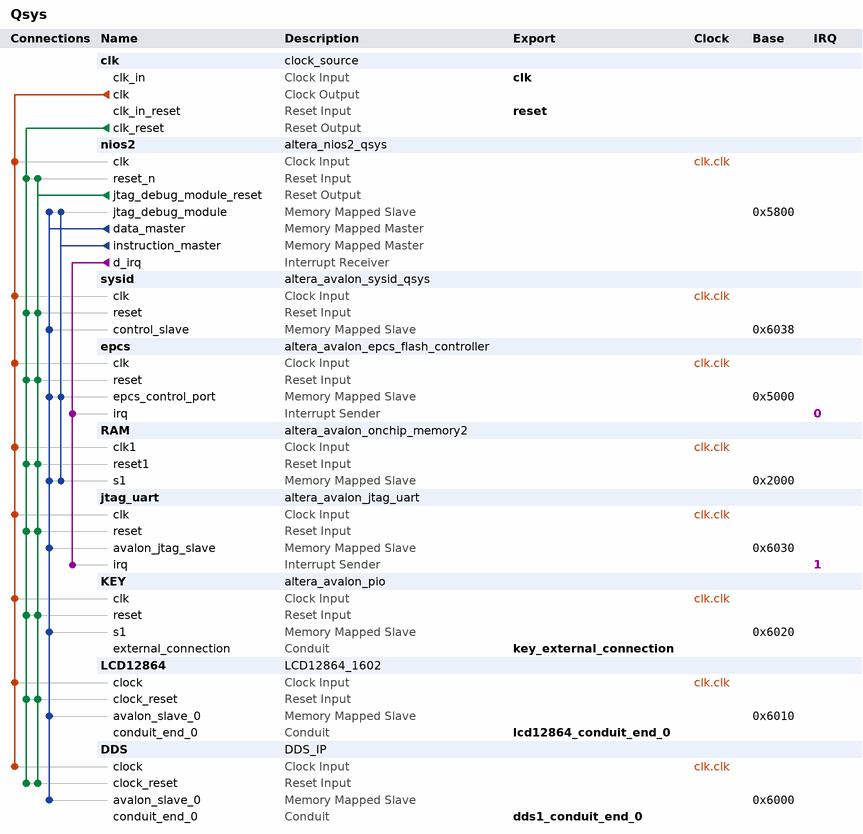
[diagram p0: system contents]
# Platform Designer (Qsys) system Qsys, Cyclone II EP2C5T144C8
# Parameters at their usual value, and those the tool derives, are not listed.
package require -exact qsys 13.0.1
create_system Qsys
set_project_property DEVICE_FAMILY {Cyclone II}
set_project_property DEVICE EP2C5T144C8

add_instance clk clock_source 13.0
set_instance_parameter_value clk clockFrequency 100000000

add_instance nios2 altera_nios2_qsys 13.0
set_instance_parameter_value nios2 resetSlave epcs.epcs_control_port
set_instance_parameter_value nios2 mmu_TLBMissExcSlave None
set_instance_parameter_value nios2 exceptionSlave RAM.s1
set_instance_parameter_value nios2 breakSlave nios2.jtag_debug_module
set_instance_parameter_value nios2 impl Tiny
set_instance_parameter_value nios2 icache_size 4096

add_instance sysid altera_avalon_sysid_qsys 13.0
set_instance_parameter_value sysid id 0

add_instance epcs altera_avalon_epcs_flash_controller 13.0.1

add_instance RAM altera_avalon_onchip_memory2 13.0.1
set_instance_parameter_value RAM dataWidth 32
set_instance_parameter_value RAM dualPort false
set_instance_parameter_value RAM initMemContent true
set_instance_parameter_value RAM initializationFileName onchip_mem.hex
set_instance_parameter_value RAM memorySize 8192

add_instance jtag_uart altera_avalon_jtag_uart 13.0.1
set_instance_parameter_value jtag_uart simInteractiveOptions NO_INTERACTIVE_WINDOWS

add_instance KEY altera_avalon_pio 13.0.1
set_instance_parameter_value KEY direction Bidir
set_instance_parameter_value KEY resetValue 255
set_instance_parameter_value KEY width 8

add_instance LCD12864 LCD12864_1602 1.0

add_instance DDS DDS_IP 6.0
set_instance_parameter_value DDS ROMAD_WIDTH 10

# connections
add_connection clk.clk DDS.clock clock
add_connection clk.clk epcs.clk clock
add_connection clk.clk jtag_uart.clk clock
add_connection clk.clk KEY.clk clock
add_connection clk.clk LCD12864.clock clock
add_connection clk.clk nios2.clk clock
add_connection clk.clk RAM.clk1 clock
add_connection clk.clk sysid.clk clock
add_connection clk.clk_reset DDS.clock_reset reset
add_connection clk.clk_reset epcs.reset reset
add_connection clk.clk_reset jtag_uart.reset reset
add_connection clk.clk_reset KEY.reset reset
add_connection clk.clk_reset LCD12864.clock_reset reset
add_connection clk.clk_reset nios2.reset_n reset
add_connection clk.clk_reset RAM.reset1 reset
add_connection clk.clk_reset sysid.reset reset
add_connection nios2.jtag_debug_module_reset DDS.clock_reset reset
add_connection nios2.jtag_debug_module_reset epcs.reset reset
add_connection nios2.jtag_debug_module_reset jtag_uart.reset reset
add_connection nios2.jtag_debug_module_reset KEY.reset reset
add_connection nios2.jtag_debug_module_reset LCD12864.clock_reset reset
add_connection nios2.jtag_debug_module_reset nios2.reset_n reset
add_connection nios2.jtag_debug_module_reset RAM.reset1 reset
add_connection nios2.jtag_debug_module_reset sysid.reset reset
add_connection nios2.data_master DDS.avalon_slave_0 avalon
set_connection_parameter_value nios2.data_master/DDS.avalon_slave_0 baseAddress 0x6000
add_connection nios2.data_master epcs.epcs_control_port avalon
set_connection_parameter_value nios2.data_master/epcs.epcs_control_port baseAddress 0x5000
add_connection nios2.data_master jtag_uart.avalon_jtag_slave avalon
set_connection_parameter_value nios2.data_master/jtag_uart.avalon_jtag_slave baseAddress 0x6030
add_connection nios2.data_master KEY.s1 avalon
set_connection_parameter_value nios2.data_master/KEY.s1 baseAddress 0x6020
add_connection nios2.data_master LCD12864.avalon_slave_0 avalon
set_connection_parameter_value nios2.data_master/LCD12864.avalon_slave_0 baseAddress 0x6010
add_connection nios2.data_master nios2.jtag_debug_module avalon
set_connection_parameter_value nios2.data_master/nios2.jtag_debug_module baseAddress 0x5800
add_connection nios2.data_master RAM.s1 avalon
set_connection_parameter_value nios2.data_master/RAM.s1 baseAddress 0x2000
add_connection nios2.data_master sysid.control_slave avalon
set_connection_parameter_value nios2.data_master/sysid.control_slave baseAddress 0x6038
add_connection nios2.instruction_master epcs.epcs_control_port avalon
set_connection_parameter_value nios2.instruction_master/epcs.epcs_control_port baseAddress 0x5000
add_connection nios2.instruction_master nios2.jtag_debug_module avalon
set_connection_parameter_value nios2.instruction_master/nios2.jtag_debug_module baseAddress 0x5800
add_connection nios2.instruction_master RAM.s1 avalon
set_connection_parameter_value nios2.instruction_master/RAM.s1 baseAddress 0x2000
add_connection nios2.d_irq epcs.irq interrupt
set_connection_parameter_value nios2.d_irq/epcs.irq irqNumber 0
add_connection nios2.d_irq jtag_uart.irq interrupt
set_connection_parameter_value nios2.d_irq/jtag_uart.irq irqNumber 1

# exported interfaces
add_interface clk clock sink
set_interface_property clk EXPORT_OF clk.clk_in
add_interface reset reset sink
set_interface_property reset EXPORT_OF clk.clk_in_reset
add_interface key_external_connection conduit end
set_interface_property key_external_connection EXPORT_OF KEY.external_connection
add_interface lcd12864_conduit_end_0 conduit end
set_interface_property lcd12864_conduit_end_0 EXPORT_OF LCD12864.conduit_end_0
add_interface dds1_conduit_end_0 conduit end
set_interface_property dds1_conduit_end_0 EXPORT_OF DDS.conduit_end_0

set_interconnect_requirement {$system} qsys_mm.clockCrossingAdapter HANDSHAKE
set_interconnect_requirement {$system} qsys_mm.maxAdditionalLatency 1

save_system Qsys.qsys
